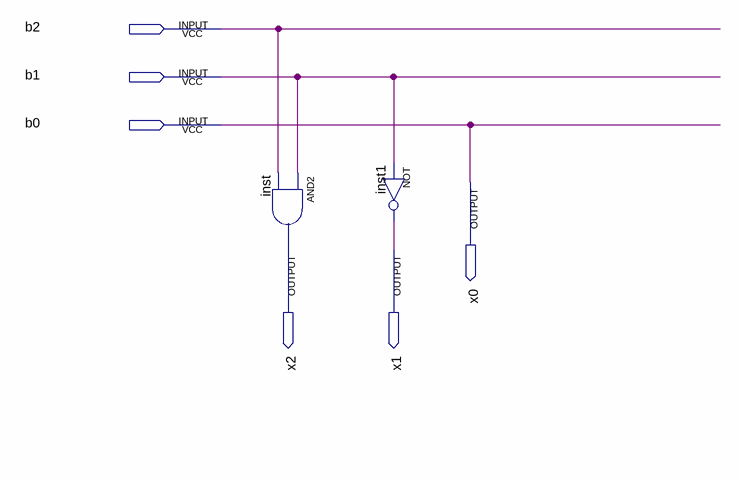
[diagram p0: schematic sheet]
// Quartus schematic koloA1.bdf as structural Verilog: 2 symbols, 6 pins
module koloA1 (
  input  b2,
  input  b1,
  input  b0,
  output x0,
  output x2,
  output x1
);

  and inst (x2, b1, b2);
  not inst1 (x1, b1);

  assign x0 = b0;
endmodule
